# EAGLE design RCM-CommX1 (EAGLE 6.5.0)
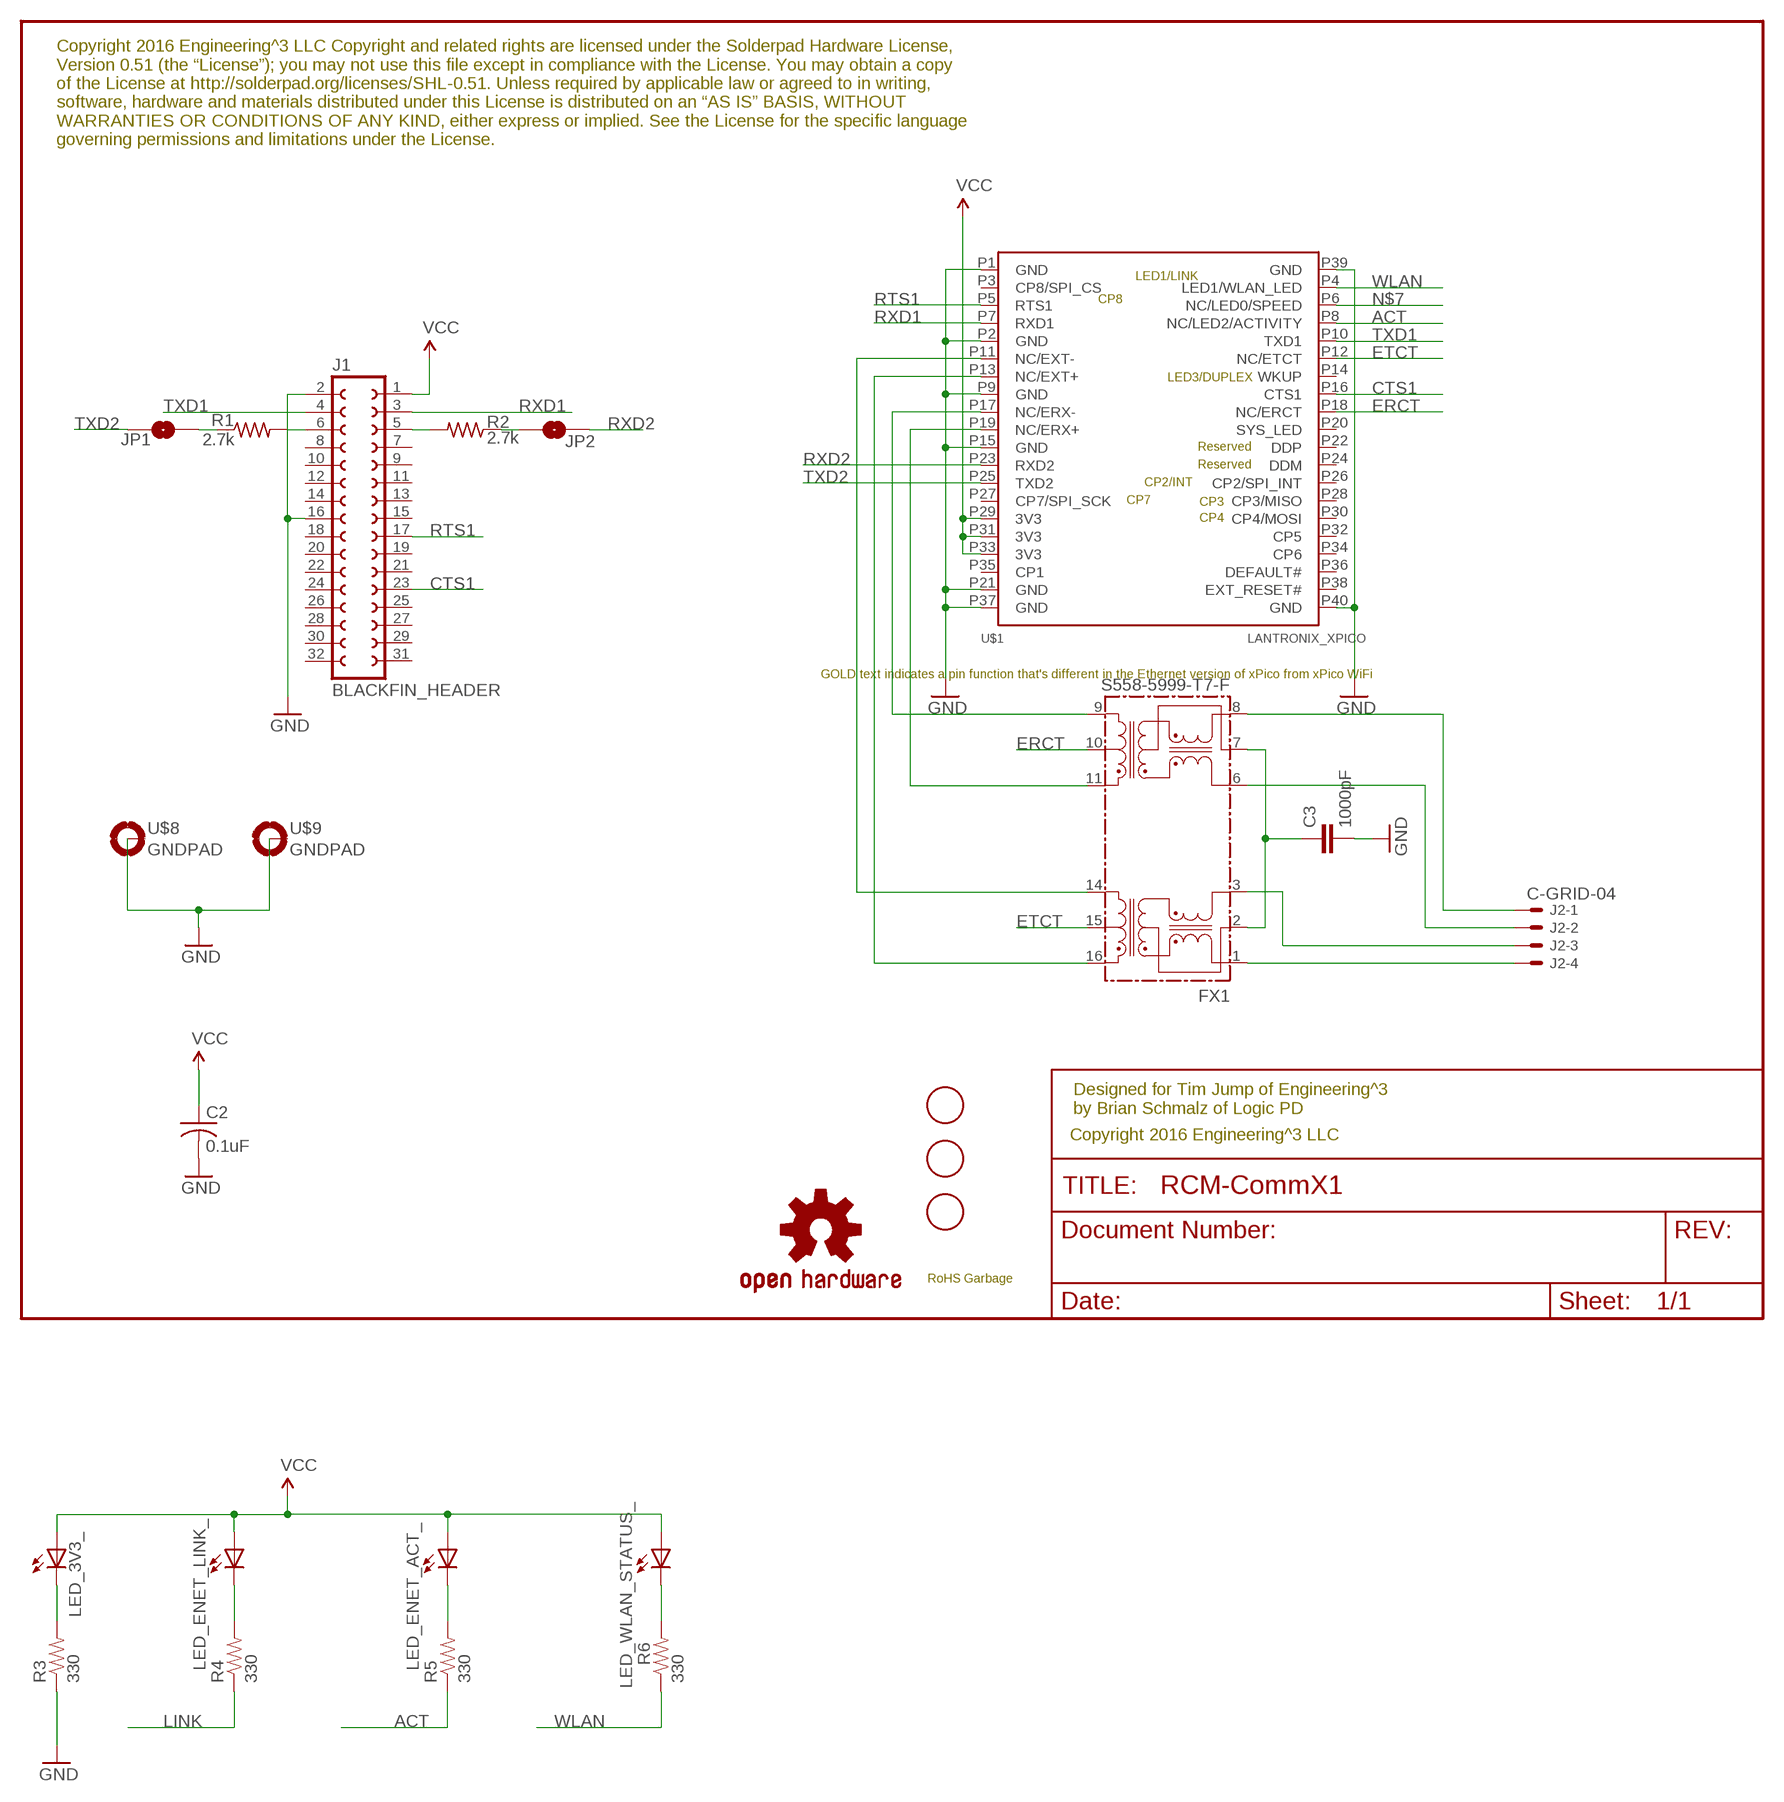
[diagram p0: schematic, sheet 1]

## Parts
C2  0.1uF  C-USC0603  [C0603]
C3  1000pF  CAP0603-CAP  [0603-CAP]
FID1  FIDUCIAL  [FIDUCIAL_1MM]
FID2  FIDUCIAL  [FIDUCIAL_1MM]
FID3  FIDUCIAL  [FIDUCIAL_1MM]
FX1  S558-5999-T7-F  TG110-E050N5  [N5]
J1  BLACKFIN_HEADER  [2X16]
J2-  C-GRID-04  [70555-04]
JP1  JUMPER-PAD-2-NOROUND  [PAD-JUMPER-2-NO_YES_SILK_ROUND]
JP2  JUMPER-PAD-2-NOROUND  [PAD-JUMPER-2-NO_YES_SILK_ROUND]
LED_3V3_  LED0603  [LED-0603]
LED_ENET_ACT_  LED0603  [LED-0603]
LED_ENET_LINK_  LED0603  [LED-0603]
LED_WLAN_STATUS_  LED0603  [LED-0603]
LOGO1  OSHW-LOGOM  [OSHW-LOGO-M]
R1  2.7k  R-US_R0603  [R0603]
R2  2.7k  R-US_R0603  [R0603]
R3  330  RESISTOR0603-RES  [0603-RES]
R4  330  RESISTOR0603-RES  [0603-RES]
R5  330  RESISTOR0603-RES  [0603-RES]
R6  330  RESISTOR0603-RES  [0603-RES]
U$1  LANTRONIX_XPICO  [LANTRONIX_XPICO]
U$3  ROHS_GARBAGE  [ROHS_GARBAGE_5MM]
U$8  GNDPAD  [GNDPAD]
U$9  GNDPAD  [GNDPAD]

## Nets
ACT: R5.1 U$1.P8(NC/LED2/ACTIVITY)
CTS1: J1.23(GP6) U$1.P16(CTS1)
ERCT: FX1.10 U$1.P18(NC/ERCT)
ETCT: FX1.15 U$1.P12(NC/ETCT)
GND: C2.2 C3.2 J1.2(GND) J1.16(GND16) R3.1 U$1.P1(GND) U$1.P2(GND) U$1.P9(GND) U$1.P15(GND) U$1.P21(GND) U$1.P37(GND) U$1.P39(GND) U$1.P40(GND) U$8.P$1(MOUNT) U$9.P$1(MOUNT)
LINK: R4.1
N$1: C3.1 FX1.2 FX1.7
N$2: JP1.2 R1.1
N$3: LED_3V3_.C R3.2
N$4: JP2.1 R2.1
N$5: LED_ENET_LINK_.C R4.2
N$6: LED_ENET_ACT_.C R5.2
N$7: U$1.P6(NC/LED0/SPEED)
N$8: LED_WLAN_STATUS_.C R6.2
N$13: FX1.16 U$1.P13(NC/EXT+)
N$14: FX1.14 U$1.P11(NC/EXT-)
N$16: FX1.11 U$1.P19(NC/ERX+)
N$17: FX1.9 U$1.P17(NC/ERX-)
N$18: FX1.1 J2-.4
N$19: FX1.3 J2-.3
N$20: FX1.8 J2-.1
N$21: FX1.6 J2-.2
N$24: J1.6(RX1) R1.2
N$26: J1.5(TX1) R2.2
RTS1: J1.17(GP0) U$1.P5(RTS1)
RXD1: J1.3(TX0) U$1.P7(RXD1)
RXD2: JP2.2 U$1.P23(RXD2)
TXD1: J1.4(RX0) U$1.P10(TXD1)
TXD2: JP1.1 U$1.P25(TXD2)
VCC: C2.1 J1.1(3.3V) LED_3V3_.A LED_ENET_ACT_.A LED_ENET_LINK_.A LED_WLAN_STATUS_.A U$1.P29(3V3) U$1.P31(3V3) U$1.P33(3V3)
WLAN: R6.1 U$1.P4(LED1/WLAN_LED)
Unconnected: J1.7(TMR2) J1.8(TMR3) J1.9(SPI_MOSI) J1.10(SPI_MISO) J1.11(SPI_SCK) J1.12(SPI_SEL) J1.13(SPI_SEL2) J1.14(SPI_SCL) J1.15(I2C_SDA) J1.18(GP1) J1.19(GP2) J1.20(GP3) J1.21(GP4) J1.22(GP5) J1.24(GP7) J1.25(GP8) J1.26(GP9) J1.27(GPA) J1.28(GPB) J1.29(GPC) J1.30(GPD) J1.31(GPE) J1.32(GPF) U$1.P3(CP8/SPI_CS) U$1.P14(WKUP) U$1.P20(SYS_LED) U$1.P22(DDP) U$1.P24(DDM) U$1.P26(CP2/SPI_INT) U$1.P27(CP7/SPI_SCK) U$1.P28(CP3/MISO) U$1.P30(CP4/MOSI) U$1.P32(CP5) U$1.P34(CP6) U$1.P35(CP1) U$1.P36(DEFAULT#) U$1.P38(EXT_RESET#)

## Notes on the sheet
- Copyright 2016 Engineering^3 LLC Copyright and related rights are licensed under the Solderpad Hardware License, 
  Version 0.51 (the “License”); you may not use this file except in compliance with the License. You may obtain a copy 
  of the License at http://solderpad.org/licenses/SHL-0.51. Unless required by applicable law or agreed to in writing, 
  software, hardware and materials distributed under this License is distributed on an “AS IS” BASIS, WITHOUT 
  WARRANTIES OR CONDITIONS OF ANY KIND, either express or implied. See the License for the specific language 
  governing permissions and limitations under the License.
- Designed for Tim Jump of Engineering^3
  by Brian Schmalz of Logic PD
- Copyright 2016 Engineering^3 LLC

## Library data of the parts
C2 = rcl:C-US: CAPACITOR, American symbol
C3 = spark_fun:CAP: Capacitor Standard 0603 ceramic capacitor, and 0.1" leaded capacitor.
FID1-FID3 = adafruit:FIDUCIAL: For use by pick and place machines to calibrate the vision/machine, 1mm By microbuilder.eu
FX1 = halo-electronics:TG110-E050N5: E-Ultra (TM) 10/100BASE-TX SOIC-16 Fast Ethernet Magnetic Modules Source: www.haloelectronics.com .. e-ultra.pdf
J1 = Surveyor:BLACKFIN_HEADER
J2- = MolexConnector:C-GRID-04
JP1 JP2 = SparkFun-Passives:JUMPER-PAD-2-NO
LED_3V3_ LED_ENET_ACT_ LED_ENET_LINK_ LED_WLAN_STATUS_ = spark_fun:LED: LEDs Standard schematic elements and footprints for 5mm, 3mm, 1206, and 0603 sized LEDs. 5mm - Spark Fun Electronics SKU : COM-00529 (and others)
LOGO1 = SparkFun-Aesthetics:OSHW-LOGO: Open Source Hardware Logo This logo indicates the piece of hardware it is found on incorporates a OSHW license and/or adheres to the definition of open source hardware found here: http://freedomdefined.org/OSHW
R1 R2 = rcl:R-US_: RESISTOR, American symbol
R3-R6 = spark_fun:RESISTOR: Resistor Basic schematic elements and footprints for 0603, 1206, and PTH resistors.
U$1 = xPico:LANTRONIX_XPICO
U$3 = SchmalzHausPublic:ROHS_GARBAGE
U$8 U$9 = Surveyor:GNDPAD

## Board
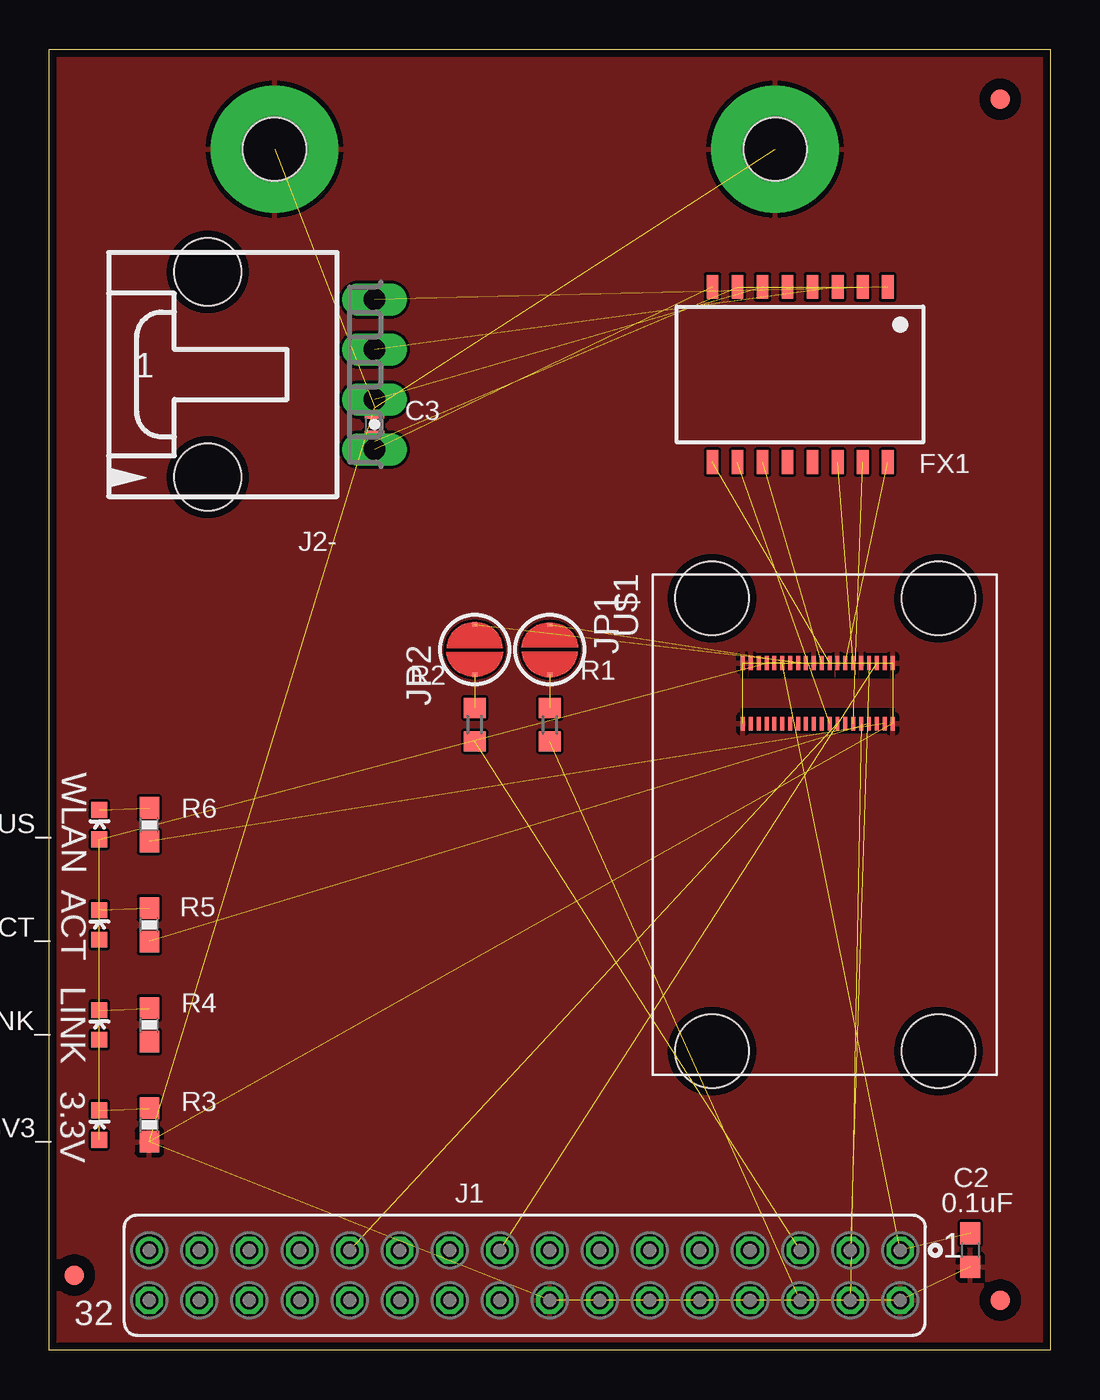
[diagram p1: board, top side]
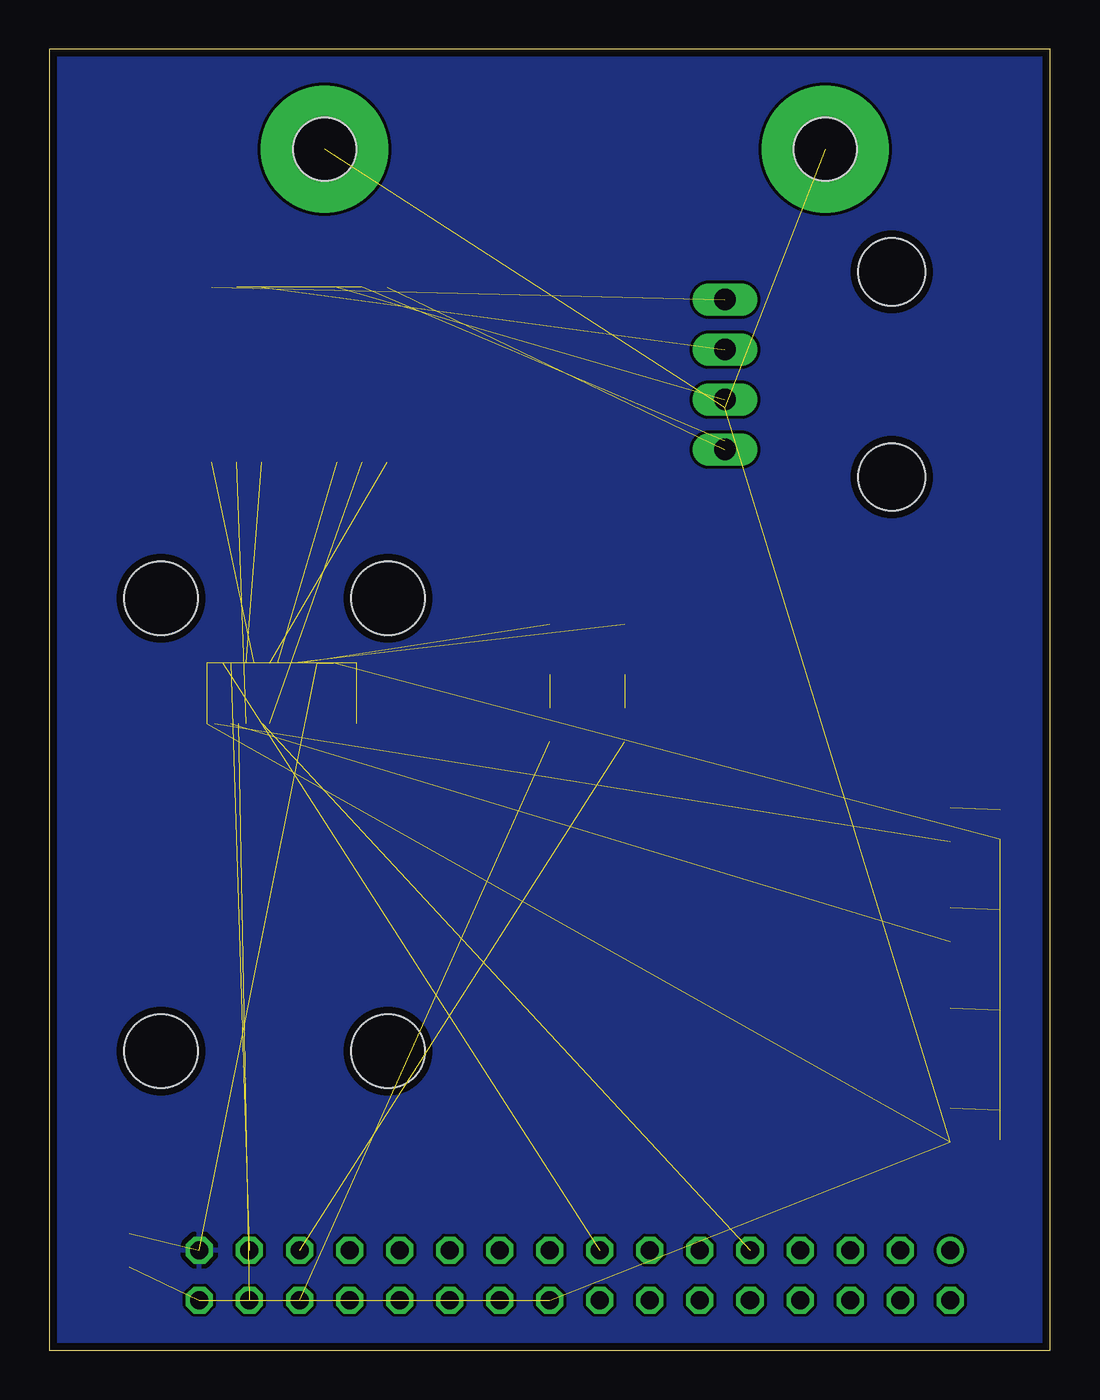
[diagram p2: board, bottom side, seen from below]

Size 50.8 x 66.05 mm. Coordinates in mm from the lower left corner, seen from the top.
Outline: 0,66.05 50.8,66.05 50.8,43.69 50.8,0 0,0.01 0,66.05
Copper layers (1*16): Top 0.0356mm / dielectric 1.5011mm / Bottom 0.0356mm
Design rules "LaenPCBOrder": minimum track width 6mil, minimum drill 13mil, track to track 6mil, track to pad 6mil, pad to pad 6mil, via to via 6mil, smd to smd 6mil, copper to edge 15mil, drill to drill 6mil, minimum pad ring 7mil, minimum via ring 7mil, stop-mask expansion 3mil, vias tented up to drill 0mil, thermal gap 10mil

### Footprints (pad centres in the part's own frame; a part is rotated, then mirrored left to right if it is on the bottom)
C0603 = smd 1.1 x 1: 1 -0.85,0; 2 0.85,0
0603-CAP = smd 1.1 x 1: 1 -0.85,0; 2 0.85,0
FIDUCIAL_1MM = smd 1 x 1: 1 0,0
N5 = smd 0.6 x 1.2: 1 -4.445,-4.445; 2 -3.175,-4.445; 3 -1.905,-4.445; 4 -0.635,-4.445; 5 0.635,-4.445; 6 1.905,-4.445; 7 3.175,-4.445; 8 4.445,-4.445; 9 4.445,4.445; 10 3.175,4.445; 11 1.905,4.445; 12 0.635,4.445; 13 -0.635,4.445; 14 -1.905,4.445; 15 -3.175,4.445; 16 -4.445,4.445
2X16 = drill 0.914 octagon: 1 20.32,1.27; 2 20.32,-1.27; 3 17.78,1.27; 4 17.78,-1.27; 5 15.24,1.27; 6 15.24,-1.27; 7 12.7,1.27; 8 12.7,-1.27; 9 10.16,1.27; 10 10.16,-1.27; 11 7.62,1.27; 12 7.62,-1.27; 13 5.08,1.27; 14 5.08,-1.27; 15 2.54,1.27; 16 2.54,-1.27; 17 0,1.27; 18 0,-1.27; 19 -2.54,1.27; 20 -2.54,-1.27; 21 -5.08,1.27; 22 -5.08,-1.27; 23 -7.62,1.27; 24 -7.62,-1.27; 25 -10.16,1.27; 26 -10.16,-1.27; 27 -12.7,1.27; 28 -12.7,-1.27; 29 -15.24,1.27; 30 -15.24,-1.27; 32 -17.78,-1.27 | drill 0.914: 31 -17.78,1.27
70555-04 = drill 1.092 long: 1 -3.81,0; 2 -1.27,0; 3 1.27,0; 4 3.81,0 | hole 3.404: -5.207,8.458; 5.207,8.458
PAD-JUMPER-2-NO_YES_SILK_ROUND = smd 0.152 x 0.305: 1 -1.27,0; 2 1.27,0
LED-0603 = smd 0.8 x 0.8: A 0,-0.75; C 0,0.75
R0603 = smd 1 x 1.1: 1 -0.85,0; 2 0.85,0
0603-RES = smd 1.1 x 1: 1 -0.85,0; 2 0.85,0
LANTRONIX_XPICO = smd 0.7 x 0.2: P1 -8.21,3.43; P2 -5.13,3.43; P3 -8.21,3.03; P4 -5.13,3.03; P5 -8.21,2.63; P6 -5.13,2.63; P7 -8.21,2.23; P8 -5.13,2.23; P9 -8.21,1.83; P10 -5.13,1.83; P11 -8.21,1.43; P12 -5.13,1.43; P13 -8.21,1.03; P14 -5.13,1.03; P15 -8.21,0.63; P16 -5.13,0.63; P17 -8.21,0.23; P18 -5.13,0.23; P19 -8.21,-0.17; P20 -5.13,-0.17; P21 -8.21,-0.57; P22 -5.13,-0.57; P23 -8.21,-0.97; P24 -5.13,-0.97; P25 -8.21,-1.37; P26 -5.13,-1.37; P27 -8.21,-1.77; P28 -5.13,-1.77; P29 -8.21,-2.17; P30 -5.13,-2.17; P31 -8.21,-2.57; P32 -5.13,-2.57; P33 -8.21,-2.97; P34 -5.13,-2.97; P35 -8.21,-3.37; P36 -5.13,-3.37; P37 -8.21,-3.77; P38 -5.13,-3.77; P39 -8.21,-4.17; P40 -5.13,-4.17 | hole 3.73: -11.5,5.75; -11.5,-5.75; 11.5,5.75; 11.5,-5.75
GNDPAD = drill 3.2 pad 6.452: P$1 0,0 | hole 3.2: 0,0

### Placement (x,y rotation side)
C2  46.74,5.08 270 top
C3  16.51,47 90 top
FID1  1.27,3.81 0 top
FID2  48.26,63.51 0 top
FID3  48.26,2.54 0 top
FX1  38.1,49.54 180 top
J1  22.86,3.81 0 top
J2-  16.51,49.54 90 top
JP1  25.4,35.57 270 top
JP2  21.59,35.57 90 top
LED_3V3_  2.54,11.44 0 top
LED_ENET_ACT_  2.54,21.59 0 top
LED_ENET_LINK_  2.54,16.52 0 top
LED_WLAN_STATUS_  2.54,26.68 0 top
LOGO1  60.96,15.25 0 bottom  (outside the outline)
R1  25.4,31.75 270 top
R2  21.59,31.75 270 top
R3  5.08,11.44 90 top
R4  5.08,16.52 90 top
R5  5.08,21.59 90 top
R6  5.08,26.68 90 top
U$1  39.37,26.68 270 top
U$3  78.74,16.52 0 bottom  (outside the outline)
U$8  11.43,60.97 90 top
U$9  36.83,60.97 0 top

### Tracks (layer width: path | path; a pad name or v marks a point on that pad's centre or on a via)
ACT  (1 unrouted)
CTS1  (1 unrouted)
ERCT  (1 unrouted)
ETCT  (1 unrouted)
GND  (14 unrouted)
  pour Top: 0,66.05 50.8,66.05 50.8,0.01 0,0.01
N$1  (2 unrouted)
N$2  (1 unrouted)
N$3  (1 unrouted)
N$4  (1 unrouted)
N$5  (1 unrouted)
N$6  (1 unrouted)
N$8  (1 unrouted)
N$13  (1 unrouted)
N$14  (1 unrouted)
N$16  (1 unrouted)
N$17  (1 unrouted)
N$18  (1 unrouted)
N$19  (1 unrouted)
N$20  (1 unrouted)
N$21  (1 unrouted)
N$24  (1 unrouted)
N$26  (1 unrouted)
RTS1  (1 unrouted)
RXD1  (1 unrouted)
RXD2  (1 unrouted)
TXD1  (1 unrouted)
TXD2  (1 unrouted)
VCC  (8 unrouted)
  pour Bottom: 0,66.05 50.8,66.05 50.8,0.01 0,0.01
WLAN  (1 unrouted)

### Text on the board
tPlace: 1 | WLAN | ACT | LINK | 3.3V
bPlace: Copyright 2015 Engineering^3 | RCM-Comm v1 (c) 2014, 2015